# Altium schematic sheet Switch.SchDoc
size A4
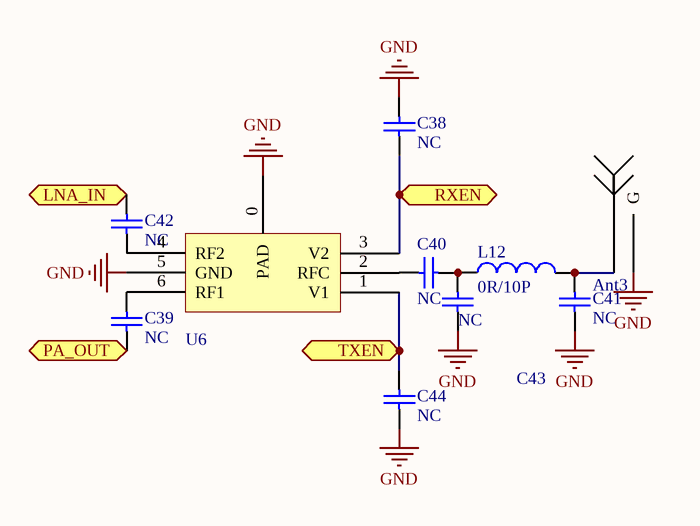
[diagram p0: Switch.SchDoc]

## Parts
Ant3  Antenna  [SMA]  (value not drawn)
C38  value NC  [0402]  (hidden comment: Cap)
C39  value NC  [0402]  (hidden comment: Cap)
C40  value NC  [0402]  (hidden comment: Cap)
C41  value NC  [0402]  (hidden comment: Cap)
C42  value NC  [0402]  (hidden comment: Cap)
C43  value NC  [0402]  (hidden comment: Cap)
C44  value NC  [0402]  (hidden comment: Cap)
L12  value 0R/10P  [0402]  (hidden comment: Inductor)
U6  SKY13370-374LF  [SKY65404-31]  (value not drawn)

## Ports
LNA_IN, PA_OUT, RXEN, TXEN

## Nets
GND: Ant3.GND(G) C38.1 C41.2 C43.2 C44.1 U6.0(PAD) U6.5(GND)
LNA_IN: C42.2 ; port LNA_IN
PA_OUT: C39.1 ; port PA_OUT
RXEN: C38.2 U6.3(V2) ; port RXEN
TXEN: C44.2 U6.1(V1) ; port TXEN
NetAnt3_1: Ant3.1 C41.1 L12.2
NetC39_2: C39.2 U6.6(RF1)
NetC40_1: C40.1 U6.2(RFC)
NetC40_2: C40.2 C43.1 L12.1
NetC42_1: C42.1 U6.4(RF2)

## Library data of the parts
C38-C44 = Cap: Capacitor; Published: 8-Jun-2000; LatestRevisionDate: 17-Jul-2002; LatestRevisionNote: Re-released for DXP Platform.; PackageReference: RAD-0.3; Publisher: Altium Limited; PackageDescription: Radial Cap, Thru-Hole; 2 Leads; 0.3 in Pin Spacing
L12 = Inductor: Code_IEC: 1005; Published: 8-Jun-2000; LatestRevisionDate: 29-May-2009; LatestRevisionNote: IPC-7351 Footprint Added.; PackageReference: 0402-A; Publisher: Altium Limited; PackageDescription: Chip Inductor; Code_JEITA: 0402